# Altium project 主机电路.PRJPCB
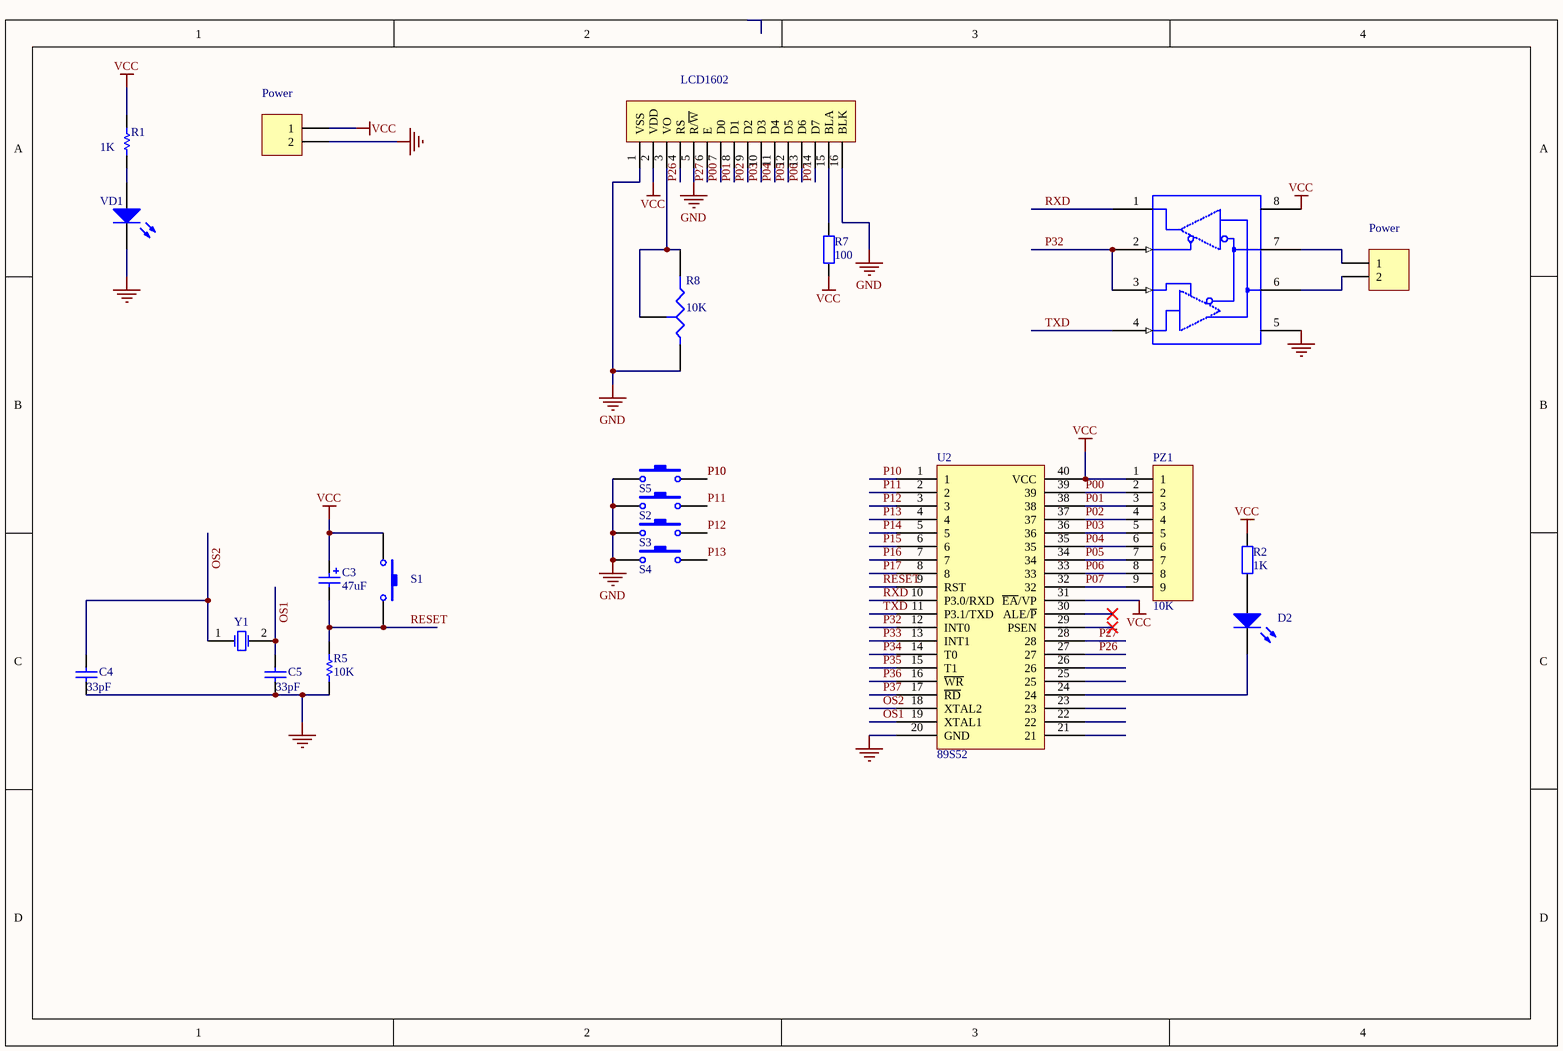
[diagram p0: 主机电路.schdoc]
1 sheet, 22 parts. Net scope: global (net labels, ports and power ports of the same name join across sheets).
Board file: 主机电路.pcbdoc

## Sheet 主机电路.schdoc
size A4; SheetNumber: 0; SheetTotal: 0

### Parts
(Parts that share a designator on the sheet are numbered #1, #2 ... from top to bottom, then left to right.)
?  (no value)  [DIP8]
C3  value 47uF  [B]  (hidden comment: 4.7uF)
C4  value 33pF  [HDR1X2]  (hidden comment: 20P)
C5  value 33pF  [HDR1X2]  (hidden comment: 20P)
D2  LED0  [LED]  (value not drawn)
LCD1602  (no value)  [1602液晶]
Power#1  (no value)  [DC-5mm]
Power#2  (no value)  [HDR1X2]
PZ1  paizu  [HDR1X9]  (value not drawn)
R1  1K  [res]
R2  1K  [res]
R5  10K  [AXIAL-0.4]
R7  value 100  [res]  (hidden comment: Res2)
R8  value 10K  [xtal2]  (hidden comment: Res Tap)
S1  SW-PB  [sw]  (value not drawn)
S2  SW-PB  [sw]  (value not drawn)
S3  SW-PB  [sw]  (value not drawn)
S4  SW-PB  [sw]  (value not drawn)
S5  SW-PB  [sw]  (value not drawn)
U2  89S52  [DIP40]
VD1  LED0  [led]  (value not drawn)
Y1  12MHz  [晶振 22.1184]  (value not drawn)

### Nets
GND: ?.5(GND) C4.1 C5.1 LCD1602.1(VSS) LCD1602.5(R/~{W}) LCD1602.16(BLK) Power#1.2 R5.1 R8.1(A) S2.1 S3.1 S4.1 S5.1 U2.20(GND) VD1.1(A)
VCC: ?.8(VCC) C3.1 LCD1602.2(VDD) Power#1.1 PZ1.1 R1.2 R2.1 R7.1 S1.1 U2.31(~{EA}/VP) U2.40(VCC)
OS1: C5.2 U2.19(XTAL1) Y1.2(OSC2)
OS2: C4.2 U2.18(XTAL2) Y1.1(OSC1)
P00: LCD1602.7(D0) PZ1.2 U2.39
P01: LCD1602.8(D1) PZ1.3 U2.38
P02: LCD1602.9(D2) PZ1.4 U2.37
P03: LCD1602.10(D3) PZ1.5 U2.36
P04: LCD1602.11(D4) PZ1.6 U2.35
P05: LCD1602.12(D5) PZ1.7 U2.34
P06: LCD1602.13(D6) PZ1.8 U2.33
P07: LCD1602.14(D7) PZ1.9 U2.32
P10: S5.2 U2.1
P11: S2.2 U2.2
P12: S3.2 U2.3
P13: S4.2 U2.4
P14: U2.5
P15: U2.6
P16: U2.7
P17: U2.8
P26: LCD1602.4(RS) U2.27
P27: LCD1602.6(E) U2.28
P32: ?.2 ?.3 U2.12(INT0)
P33: U2.13(INT1)
P34: U2.14(T0)
P35: U2.15(T1)
P36: U2.16(~{WR})
P37: U2.17(~{RD})
RESET: C3.2 R5.2 S1.2 U2.9(RST)
RXD: ?.1 U2.10(P3.0/RXD)
TXD: ?.4 U2.11(P3.1/TXD)
Net?_6: ?.6 Power#2.2
Net?_7: ?.7 Power#2.1
NetD2_1: D2.1(A) R2.2
NetD2_2: D2.2(K) U2.24
NetLCD1602_3: LCD1602.3(VO) R8.2(B) R8.3(TAP)
NetLCD1602_15: LCD1602.15(BLA) R7.2
NetR1_1: R1.1 VD1.2(K)

Not connected (* = marked no-connect by the designer): U2 21 22 23 25 26 29(PSEN)* 30(ALE/~{P})*

### Notes on the sheet
- (in symbol pai zu) 10K

### Library data of the parts
? = Pro3052.TMP_75176_22
C3 = Cap Pol2: Polarized Capacitor (Axial); Published: 8-Jun-2000; LatestRevisionDate: 17-Jul-2002; LatestRevisionNote: Re-released for DXP Platform.; PackageReference: POLAR0.8; Publisher: Altium Limited
C4 C5 = Cap: Capacitor; Published: 8-Jun-2000; LatestRevisionDate: 17-Jul-2002; LatestRevisionNote: Re-released for DXP Platform.; PackageReference: RAD-0.3; Publisher: Altium Limited
D2 VD1 = LED0: Typical INFRARED GaAs LED; Published: 8-Jun-2000; LatestRevisionDate: 08-Jul-2005; LatestRevisionNote: Mech Layer 1 removed.; PackageReference: LED-0; Publisher: Altium Limited
LCD1602 = 1602
Power#1 Power#2 = Header 2: Header, 2-Pin; LatestRevisionDate: 17-Jul-2002; LatestRevisionNote: Re-released for DXP Platform.; Publisher: Altium Limited
PZ1 = pai zu
R1 R5 = Res1: Resistor; Published: 8-Jun-2000; LatestRevisionDate: 17-Jul-2002; LatestRevisionNote: Re-released for DXP Platform.; PackageReference: AXIAL-0.3; Publisher: Altium Limited
  R1: Value: 1K
  R5: Value: 10K
R2 R7 = Res2: Resistor; Published: 8-Jun-2000; LatestRevisionDate: 17-Jul-2002; LatestRevisionNote: Re-released for DXP Platform.; PackageReference: AXIAL-0.4; Publisher: Altium Limited
  R2: Value: 1K
R8 = Res Tap: Tapped Resistor; Sim Note: Enter the Resistance value and the set point into parameter fields.; Set Position: 0.5; Published: 24-Mar-1999; LatestRevisionDate: 17-Jul-2002; LatestRevisionNote: Re-released for DXP Platform.; PackageReference: VR3; Publisher: Altium Limited
S1-S5 = SW-PB: Switch; Published: 24-Mar-1999; LatestRevisionDate: 17-Jul-2002; LatestRevisionNote: Re-released for DXP Platform.; PackageReference: SPST-2; Publisher: Altium Limited
Y1 = XTAL: Crystal Oscillator; Published: 8-Jun-2000; LatestRevisionDate: 17-Jul-2002; LatestRevisionNote: Re-released for DXP Platform.; PackageReference: R38; Publisher: Altium Limited